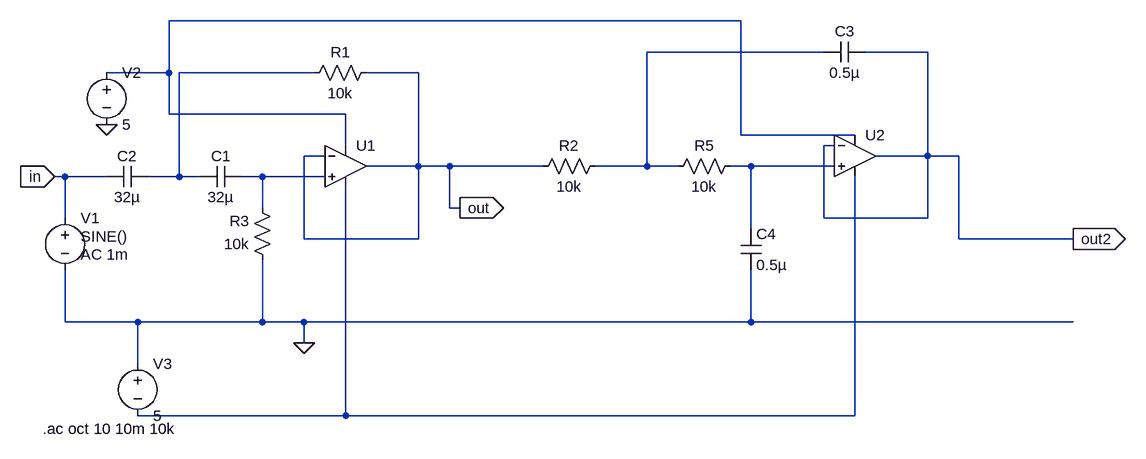
[diagram p0: schematic Cascaded sallen key.asc]
Cascaded sallen key.asc, the LTspice schematic file:
Version 4
SHEET 1 880 884
WIRE 0 240 -880 240
WIRE 128 288 -144 288
WIRE 288 288 192 288
WIRE -880 320 -880 240
WIRE -880 320 -976 320
WIRE -656 320 -864 320
WIRE -496 320 -576 320
WIRE -880 384 -880 320
WIRE -608 384 -880 384
WIRE 0 416 0 240
WIRE 176 416 0 416
WIRE -608 432 -608 384
WIRE 144 432 128 432
WIRE -640 448 -672 448
WIRE 288 448 288 288
WIRE 288 448 208 448
WIRE 336 448 288 448
WIRE -496 464 -496 320
WIRE -496 464 -576 464
WIRE -448 464 -496 464
WIRE -304 464 -448 464
WIRE -144 464 -144 288
WIRE -144 464 -224 464
WIRE -96 464 -144 464
WIRE 16 464 -16 464
WIRE 144 464 16 464
WIRE -1040 480 -1056 480
WIRE -976 480 -1040 480
WIRE -864 480 -864 320
WIRE -864 480 -912 480
WIRE -832 480 -864 480
WIRE -736 480 -768 480
WIRE -640 480 -736 480
WIRE -736 528 -736 480
WIRE -448 528 -448 464
WIRE -432 528 -448 528
WIRE -1040 544 -1040 480
WIRE 128 544 128 432
WIRE 288 544 288 448
WIRE 288 544 128 544
WIRE 16 560 16 464
WIRE -672 576 -672 448
WIRE -496 576 -496 464
WIRE -496 576 -672 576
WIRE 336 576 336 448
WIRE 512 576 336 576
WIRE -1040 704 -1040 624
WIRE -928 704 -1040 704
WIRE -736 704 -736 608
WIRE -736 704 -928 704
WIRE -672 704 -736 704
WIRE 16 704 16 624
WIRE 16 704 -672 704
WIRE 512 704 16 704
WIRE -672 736 -672 704
WIRE -928 768 -928 704
WIRE -608 848 -608 496
WIRE -608 848 -928 848
WIRE 176 848 176 480
WIRE 176 848 -608 848
FLAG -672 736 0
FLAG -976 400 0
FLAG -432 528 out
IOPIN -432 528 Out
FLAG -1056 480 in
IOPIN -1056 480 In
FLAG 512 576 out2
IOPIN 512 576 Out
SYMBOL Opamps\\UniversalOpamp2 -608 464 R0
SYMATTR InstName U1
SYMBOL Opamps\\UniversalOpamp2 176 448 R0
SYMATTR InstName U2
SYMBOL res -560 304 R90
WINDOW 0 0 56 VBottom 2
WINDOW 3 32 56 VTop 2
SYMATTR InstName R1
SYMATTR Value 10k
SYMBOL res -720 624 R180
WINDOW 0 36 76 Left 2
WINDOW 3 36 40 Left 2
SYMATTR InstName R3
SYMATTR Value 10k
SYMBOL cap -768 464 R90
WINDOW 0 0 32 VBottom 2
WINDOW 3 32 32 VTop 2
SYMATTR InstName C1
SYMATTR Value 32µ
SYMBOL cap -912 464 R90
WINDOW 0 0 32 VBottom 2
WINDOW 3 32 32 VTop 2
SYMATTR InstName C2
SYMATTR Value 32µ
SYMBOL voltage -1040 528 R0
WINDOW 3 24 44 Left 2
WINDOW 123 24 72 Left 2
WINDOW 39 0 0 Left 0
SYMATTR InstName V1
SYMATTR Value SINE()
SYMATTR Value2 AC 1m
SYMBOL voltage -976 304 R0
SYMATTR InstName V2
SYMATTR Value 5
SYMBOL voltage -928 752 R0
SYMATTR InstName V3
SYMATTR Value 5
SYMBOL res -208 448 R90
WINDOW 0 0 56 VBottom 2
WINDOW 3 32 56 VTop 2
SYMATTR InstName R2
SYMATTR Value 10k
SYMBOL res 0 448 R90
WINDOW 0 0 56 VBottom 2
WINDOW 3 32 56 VTop 2
SYMATTR InstName R5
SYMATTR Value 10k
SYMBOL cap 192 272 R90
WINDOW 0 0 32 VBottom 2
WINDOW 3 32 32 VTop 2
SYMATTR InstName C3
SYMATTR Value 0.5µ
SYMBOL cap 0 560 R0
SYMATTR InstName C4
SYMATTR Value 0.5µ
TEXT -1074 868 Left 2 !.ac oct 10 10m 10k

The netlist it stands for:
* Cascaded sallen key.asc
XU1 N005 out N001 N006 out level.2 Avol=1Meg GBW=10Meg Slew=10Meg ilimit=25m rail=0 Vos=0 phimargin=45 en=0 enk=0 in=0 ink=0 Rin=500Meg  ; pins IN+ IN- V+ V- OUT
XU2 N004 out2 N001 N006 out2 level.2 Avol=1Meg GBW=10Meg Slew=10Meg ilimit=25m rail=0 Vos=0 phimargin=45 en=0 enk=0 in=0 ink=0 Rin=500Meg  ; pins IN+ IN- V+ V- OUT
R1 out N003 10k
R3 0 N005 10k
C1 N005 N003 32µ
C2 N003 in 32µ
V1 in 0 SINE() AC 1m
V2 N001 0 5
V3 0 N006 5
R2 N002 out 10k
R5 N004 N002 10k
C3 out2 N002 0.5µ
C4 N004 0 0.5µ
.ac oct 10 10m 10k
.lib UniversalOpamps2.sub
.backanno
.end